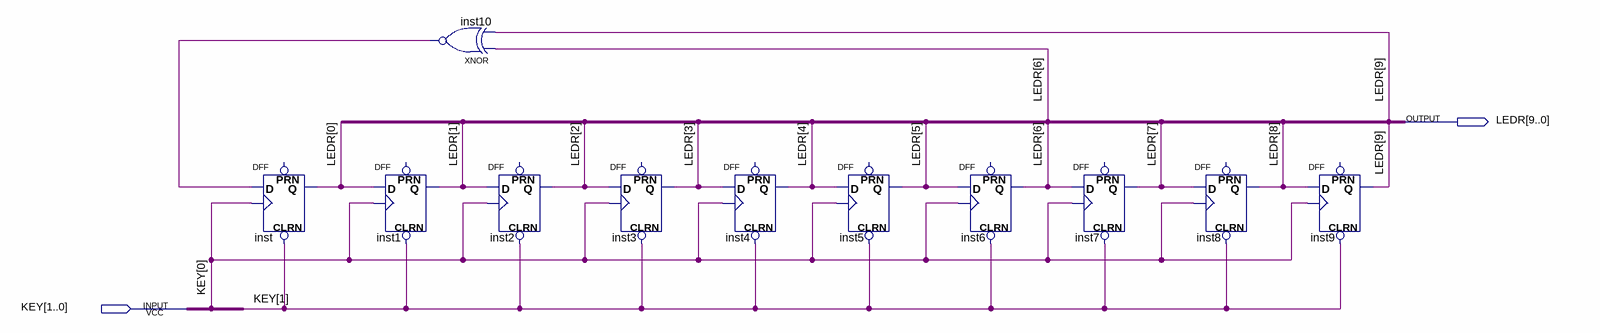
[diagram p0: schematic sheet]
// Quartus schematic lfsr10bit.bdf as structural Verilog: 11 symbols, 2 pins
module lfsr10bit (
  input  [1:0] KEY,
  output [9:0] LEDR
);

  wire inst10_out;

  DFF inst (.CLRN(KEY[1]), .CLK(KEY[0]), .D(inst10_out), .Q(LEDR[0]));  // open: PRN
  DFF inst1 (.CLRN(KEY[1]), .CLK(KEY[0]), .D(LEDR[0]), .Q(LEDR[1]));  // open: PRN
  xnor inst10 (inst10_out, LEDR[6], LEDR[9]);
  DFF inst2 (.CLRN(KEY[1]), .CLK(KEY[0]), .D(LEDR[1]), .Q(LEDR[2]));  // open: PRN
  DFF inst3 (.CLRN(KEY[1]), .CLK(KEY[0]), .D(LEDR[2]), .Q(LEDR[3]));  // open: PRN
  DFF inst4 (.CLRN(KEY[1]), .CLK(KEY[0]), .D(LEDR[3]), .Q(LEDR[4]));  // open: PRN
  DFF inst5 (.CLRN(KEY[1]), .CLK(KEY[0]), .D(LEDR[4]), .Q(LEDR[5]));  // open: PRN
  DFF inst6 (.CLRN(KEY[1]), .CLK(KEY[0]), .D(LEDR[5]), .Q(LEDR[6]));  // open: PRN
  DFF inst7 (.CLRN(KEY[1]), .CLK(KEY[0]), .D(LEDR[6]), .Q(LEDR[7]));  // open: PRN
  DFF inst8 (.CLRN(KEY[1]), .CLK(KEY[0]), .D(LEDR[7]), .Q(LEDR[8]));  // open: PRN
  DFF inst9 (.CLRN(KEY[1]), .CLK(KEY[0]), .D(LEDR[8]), .Q(LEDR[9]));  // open: PRN
endmodule
